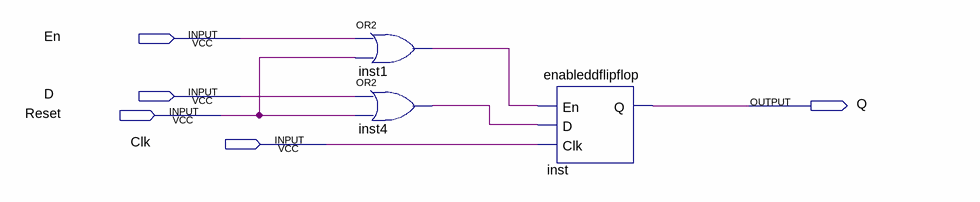
[diagram p0: schematic sheet]
// Quartus schematic displaySwitch.bdf as structural Verilog: 3 symbols, 5 pins
module displaySwitch (
  input  En,
  input  D,
  input  Reset,
  input  Clk,
  output Q
);

  wire inst1_out, inst4_out;

  or inst1 (inst1_out, En, Reset);
  or inst4 (inst4_out, D, Reset);
  enableddflipflop inst (.En(inst1_out), .D(inst4_out), .Clk(Clk), .Q(Q));
endmodule
